# Altium schematic sheet RS485.SchDoc
size A4
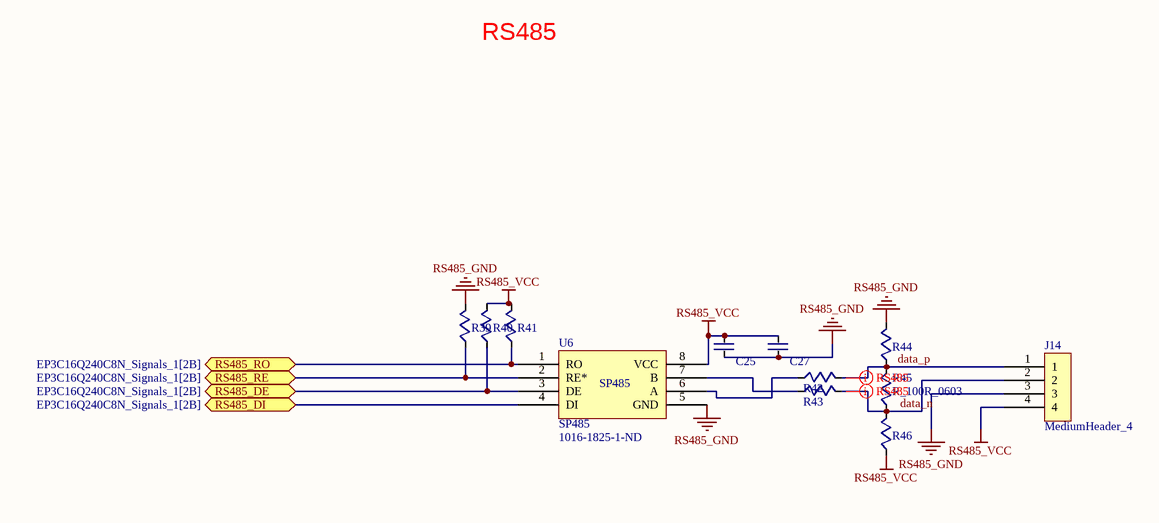
[diagram p0: RS485.SchDoc]

## Parts
C25  100n Cer  [CN-SMD-0805]  (value not drawn)
C27  10n Cer  [CN-SMD-0805]  (value not drawn)
J14  MediumHeader_4  [Medium - Header 4]
R39  R_10K_0603  [RESC_0603]  (value not drawn)
R40  R_10K_0603  [RESC_0603]  (value not drawn)
R41  R_4K99_0603  [RESC_0603]  (value not drawn)
R42  R_10K_0603  [RESC_0603]  (value not drawn)
R43  R_10R_0603  [RESC_0603]  (value not drawn)
R44  R_2K_0603  [RESC_0603]  (value not drawn)
R45  R_100R_0603  [RESC_0603]
R46  R_2K_0603  [RESC_0603]  (value not drawn)
U6  SP485  Supplier Part Number 1: 1016-1825-1-ND  [SOP8]

## Ports
RS485_DE (see EP3C16Q240C8N_Signals_1[2B]), RS485_DI (see EP3C16Q240C8N_Signals_1[2B]), RS485_RE (see EP3C16Q240C8N_Signals_1[2B]), RS485_RO (see EP3C16Q240C8N_Signals_1[2B])

## Nets
RS485_GND: C25.1 C27.1 J14.3 R39.2 R44.2 U6.5(GND)
RS485_VCC: C25.2 C27.2 J14.4 R40.2 R41.2 R46.1 U6.8(VCC)
data_n: J14.2 R43.2 R45.1 R46.2
data_p: J14.1 R42.2 R44.1 R45.2
RS485_DE: R40.1 U6.3(DE) ; port RS485_DE
RS485_DI: U6.4(DI) ; port RS485_DI
RS485_RE: R39.1 U6.2(RE*) ; port RS485_RE
RS485_RO: R41.1 U6.1(RO) ; port RS485_RO
NetR42_1: R42.1 U6.6(A)
NetR43_1: R43.1 U6.7(B)

## Layout directives
differential pair: data_n, data_p

## Notes on the sheet
- RS485
- Title
- Size:
- Date:
- A4
- Number:
- Time:
- Revision:
- Sheet
- of
- File:

## Library data of the parts
C25 = CAPC0805_104: CAP CER 0.1UF 25V 10% X7R 0805; Supplier 1: Digi-Key; Supplier Part Number 1: 399-1168-2-ND
C27 = CAPC0805_103: CAP CER 10000PF 100V X7R 0805; Supplier 1: Digi-Key; Supplier Part Number 1: 399-1159-1-ND
R39 R40 R42 = RES0603_10K: RES 10.0K OHM 1/10W 1% 0603 SMD; Supplier 1: Digi-Key; Supplier Part Number 1: 311-10.0KHRCT-ND
R41 = RES0603_4K99: RES 4.99K OHM 1/10W 1% 0603 SMD; Supplier 1: Digi-Key; Supplier Part Number 1: P4.99KHDKR-ND
R43 = RES0603_10R: RES 10.0 OHM 1/10W 0603 SMD; Supplier 1: Digi-Key; Supplier Part Number 1: 311-10.0HRCT-ND
R44 R46 = RES0603_2K: RES 2K OHM 1/10W 0603 SMD; Supplier 1: Digi-Key; Supplier Part Number 1: P2.0KDBDKR-ND
R45 = RES0603_100R: RES 100 OHM 1/10W 5% 0603 SMD; Supplier 1: Digi-Key; Supplier Part Number 1: P100GDKR-ND
U6 = SP485: IC TXRX RS485 HALF DUPLEX 8SOIC; Supplier 1: Digi-Key